# Altium schematic sheet S6D01D4NucleoExtensionBoard.SchDoc
size A4; Organization: BME AUT; Address1: Magyar tudósok krt. 2.; Address2: Q épület; Address3: Budapest; Address4: H-1117; DocumentNumber: 1; SheetNumber: 1; SheetTotal: 2
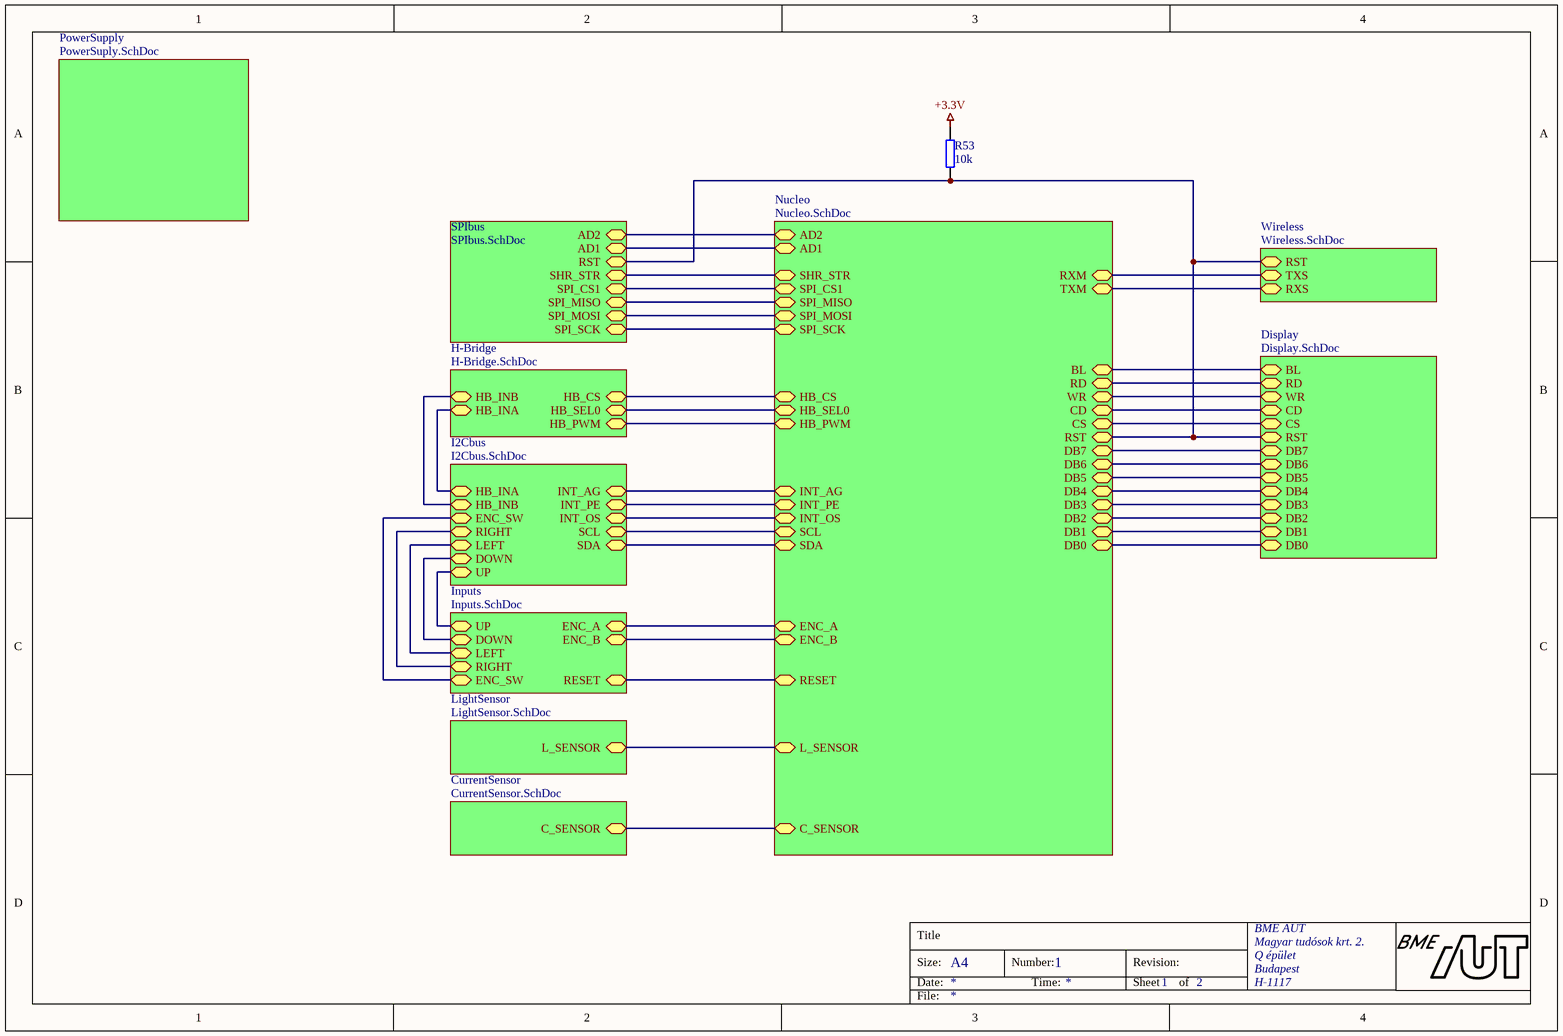
[diagram p0: S6D01D4NucleoExtensionBoard.SchDoc]

## Parts
R53  10k  [RES 0805]

## Sub-sheets
CurrentSensor = CurrentSensor.SchDoc: C_SENSOR (bidir)
Display = Display.SchDoc: DB1 (bidir), DB2 (bidir), DB0 (bidir), DB3 (bidir), DB4 (bidir), DB5 (bidir), DB6 (bidir), WR (bidir), CD (bidir), DB7 (bidir), RD (bidir), CS (bidir), RST (bidir), BL (bidir)
H-Bridge = H-Bridge.SchDoc: HB_CS (bidir), HB_SEL0 (bidir), HB_INB (bidir), HB_PWM (bidir), HB_INA (bidir)
I2Cbus = I2Cbus.SchDoc: LEFT (bidir), INT_PE (bidir), SDA (bidir), DOWN (bidir), SCL (bidir), RIGHT (bidir), ENC_SW (bidir), INT_AG (bidir), UP (bidir), INT_OS (bidir), HB_INA (bidir), HB_INB (bidir)
Inputs = Inputs.SchDoc: UP (bidir), ENC_SW (bidir), ENC_A (bidir), LEFT (bidir), DOWN (bidir), ENC_B (bidir), RIGHT (bidir), RESET (bidir)
LightSensor = LightSensor.SchDoc: L_SENSOR (bidir)
Nucleo = Nucleo.SchDoc: DB1 (bidir), DB2 (bidir), DB4 (bidir), DB0 (bidir), DB3 (bidir), DB5 (bidir), DB6 (bidir), WR (bidir), CD (bidir), DB7 (bidir), RD (bidir), CS (bidir), RST (bidir), BL (bidir), RXM (bidir), TXM (bidir), SPI_MOSI (bidir), SPI_SCK (bidir), SPI_CS1 (bidir), SPI_MISO (bidir), SHR_STR (bidir), SDA (bidir), SCL (bidir), RESET (bidir), ENC_A (bidir), ENC_B (bidir), INT_PE (bidir), INT_OS (bidir), INT_AG (bidir), HB_SEL0 (bidir), HB_CS (bidir), HB_PWM (bidir), L_SENSOR (bidir), AD1 (bidir), AD2 (bidir), C_SENSOR (bidir)
PowerSupply = PowerSuply.SchDoc: no entries
SPIbus = SPIbus.SchDoc: SPI_CS1 (bidir), SPI_SCK (bidir), SPI_MOSI (bidir), SHR_STR (bidir), SPI_MISO (bidir), RST (bidir), AD2 (bidir), AD1 (bidir)
Wireless = Wireless.SchDoc: RXS (bidir), TXS (bidir), RST (bidir)

## Nets
+3.3V: R53.2
NetR53_1: R53.1 ; sheet Display/RST, sheet Nucleo/RST, sheet Wireless/RST, sheet SPIbus/RST
(unnamed): sheet Display/DB1, sheet Nucleo/DB1
(unnamed): sheet Display/DB2, sheet Nucleo/DB2
(unnamed): sheet Display/DB0, sheet Nucleo/DB0
(unnamed): sheet Display/DB3, sheet Nucleo/DB3
(unnamed): sheet Display/DB4, sheet Nucleo/DB4
(unnamed): sheet Display/DB5, sheet Nucleo/DB5
(unnamed): sheet Display/DB6, sheet Nucleo/DB6
(unnamed): sheet Display/WR, sheet Nucleo/WR
(unnamed): sheet Display/CD, sheet Nucleo/CD
(unnamed): sheet Display/DB7, sheet Nucleo/DB7
(unnamed): sheet Display/RD, sheet Nucleo/RD
(unnamed): sheet Display/CS, sheet Nucleo/CS
(unnamed): sheet Display/BL, sheet Nucleo/BL
(unnamed): sheet Nucleo/RXM, sheet Wireless/TXS
(unnamed): sheet Nucleo/TXM, sheet Wireless/RXS
(unnamed): sheet Nucleo/SPI_MOSI, sheet SPIbus/SPI_MOSI
(unnamed): sheet Nucleo/SPI_SCK, sheet SPIbus/SPI_SCK
(unnamed): sheet Nucleo/SPI_CS1, sheet SPIbus/SPI_CS1
(unnamed): sheet Nucleo/SPI_MISO, sheet SPIbus/SPI_MISO
(unnamed): sheet Nucleo/SHR_STR, sheet SPIbus/SHR_STR
(unnamed): sheet Nucleo/SDA, sheet I2Cbus/SDA
(unnamed): sheet Nucleo/SCL, sheet I2Cbus/SCL
(unnamed): sheet Nucleo/RESET, sheet Inputs/RESET
(unnamed): sheet Nucleo/ENC_A, sheet Inputs/ENC_A
(unnamed): sheet Nucleo/ENC_B, sheet Inputs/ENC_B
(unnamed): sheet Nucleo/INT_PE, sheet I2Cbus/INT_PE
(unnamed): sheet Nucleo/INT_OS, sheet I2Cbus/INT_OS
(unnamed): sheet Nucleo/INT_AG, sheet I2Cbus/INT_AG
(unnamed): sheet Nucleo/HB_SEL0, sheet H-Bridge/HB_SEL0
(unnamed): sheet Nucleo/HB_CS, sheet H-Bridge/HB_CS
(unnamed): sheet Nucleo/HB_PWM, sheet H-Bridge/HB_PWM
(unnamed): sheet Nucleo/L_SENSOR, sheet LightSensor/L_SENSOR
(unnamed): sheet Nucleo/AD1, sheet SPIbus/AD1
(unnamed): sheet Nucleo/AD2, sheet SPIbus/AD2
(unnamed): sheet Nucleo/C_SENSOR, sheet CurrentSensor/C_SENSOR
(unnamed): sheet I2Cbus/LEFT, sheet Inputs/LEFT
(unnamed): sheet I2Cbus/DOWN, sheet Inputs/DOWN
(unnamed): sheet I2Cbus/RIGHT, sheet Inputs/RIGHT
(unnamed): sheet I2Cbus/ENC_SW, sheet Inputs/ENC_SW
(unnamed): sheet I2Cbus/UP, sheet Inputs/UP
(unnamed): sheet I2Cbus/HB_INA, sheet H-Bridge/HB_INA
(unnamed): sheet I2Cbus/HB_INB, sheet H-Bridge/HB_INB

## Notes on the sheet
- Title
- Size:
- Date:
- A4
- Number:
- Time:
- Revision:
- Sheet
- of
- File:

## Library data of the parts
R53 = RES: RESISTOR; REFERENCE ID: *; DISTRIBUTOR: *; VALUE: 10k